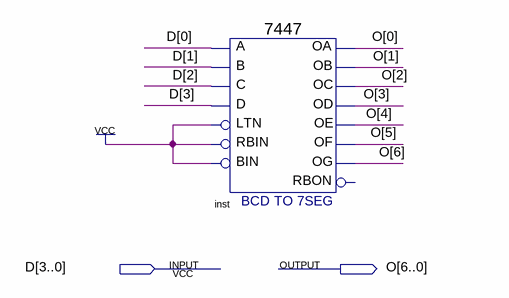
[diagram p0: schematic sheet]
// Quartus schematic 7447pro.bdf as structural Verilog: 1 symbols, 2 pins
module \7447pro  (
  input  [3:0] D,
  output [6:0] O
);

  \7447  inst (
    .LTN(1'b1), .B(D[1]), .C(D[2]), .D(D[3]), .RBIN(1'b1), .BIN(1'b1), .A(D[0]), .OB(O[1]), .OC(O[2]),
    .OE(O[4]), .OD(O[3]), .OF(O[5]), .OG(O[6]), .OA(O[0]));  // open: RBON
endmodule
